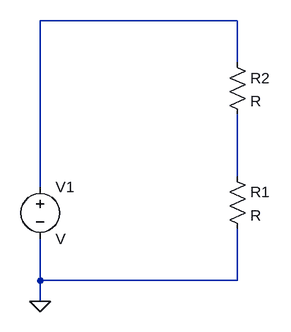
[diagram p0: schematic Draft3.asc]
Draft3.asc, the LTspice schematic file:
Version 4
SHEET 1 880 680
WIRE 384 -112 80 -112
WIRE 384 -48 384 -112
WIRE 384 128 384 32
WIRE 80 144 80 -112
WIRE 80 288 80 224
WIRE 384 288 384 208
WIRE 384 288 80 288
WIRE 80 320 80 288
FLAG 80 320 0
SYMBOL voltage 80 128 R0
SYMATTR InstName V1
SYMBOL res 368 112 R0
SYMATTR InstName R1
SYMBOL res 368 -64 R0
SYMATTR InstName R2

The netlist it stands for:
* Draft3.asc
V1 N001 0 V
R1 N002 0 R
R2 N001 N002 R
.backanno
.end